# EAGLE design final_stm_shield (EAGLE 9.5.2)
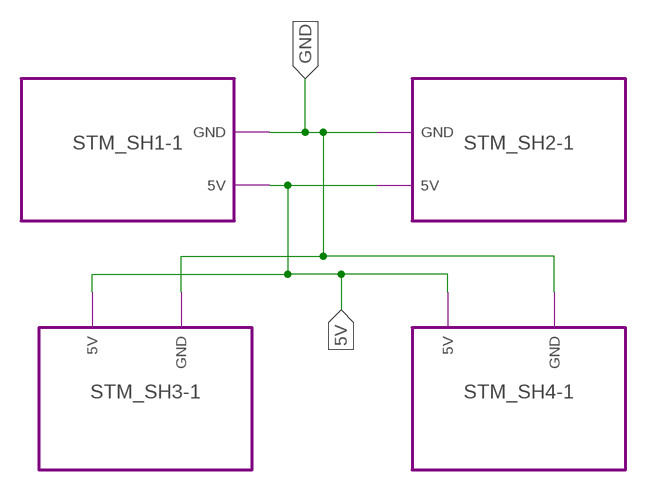
[diagram p0: schematic, sheet 1]

## Module instances
STM_SH1-1 = STM_SH1
STM_SH2-1 = STM_SH2
STM_SH3-1 = STM_SH3
STM_SH4-1 = STM_SH4

## Nets
5V: port STM_SH1-1.5V STM_SH2-1.5V STM_SH4-1.5V STM_SH3-1.5V
GND: port STM_SH1-1.GND STM_SH2-1.GND STM_SH4-1.GND STM_SH3-1.GND

## Library data of the parts

## Module STM_SH1
Ports: 5V(out) GND(out)
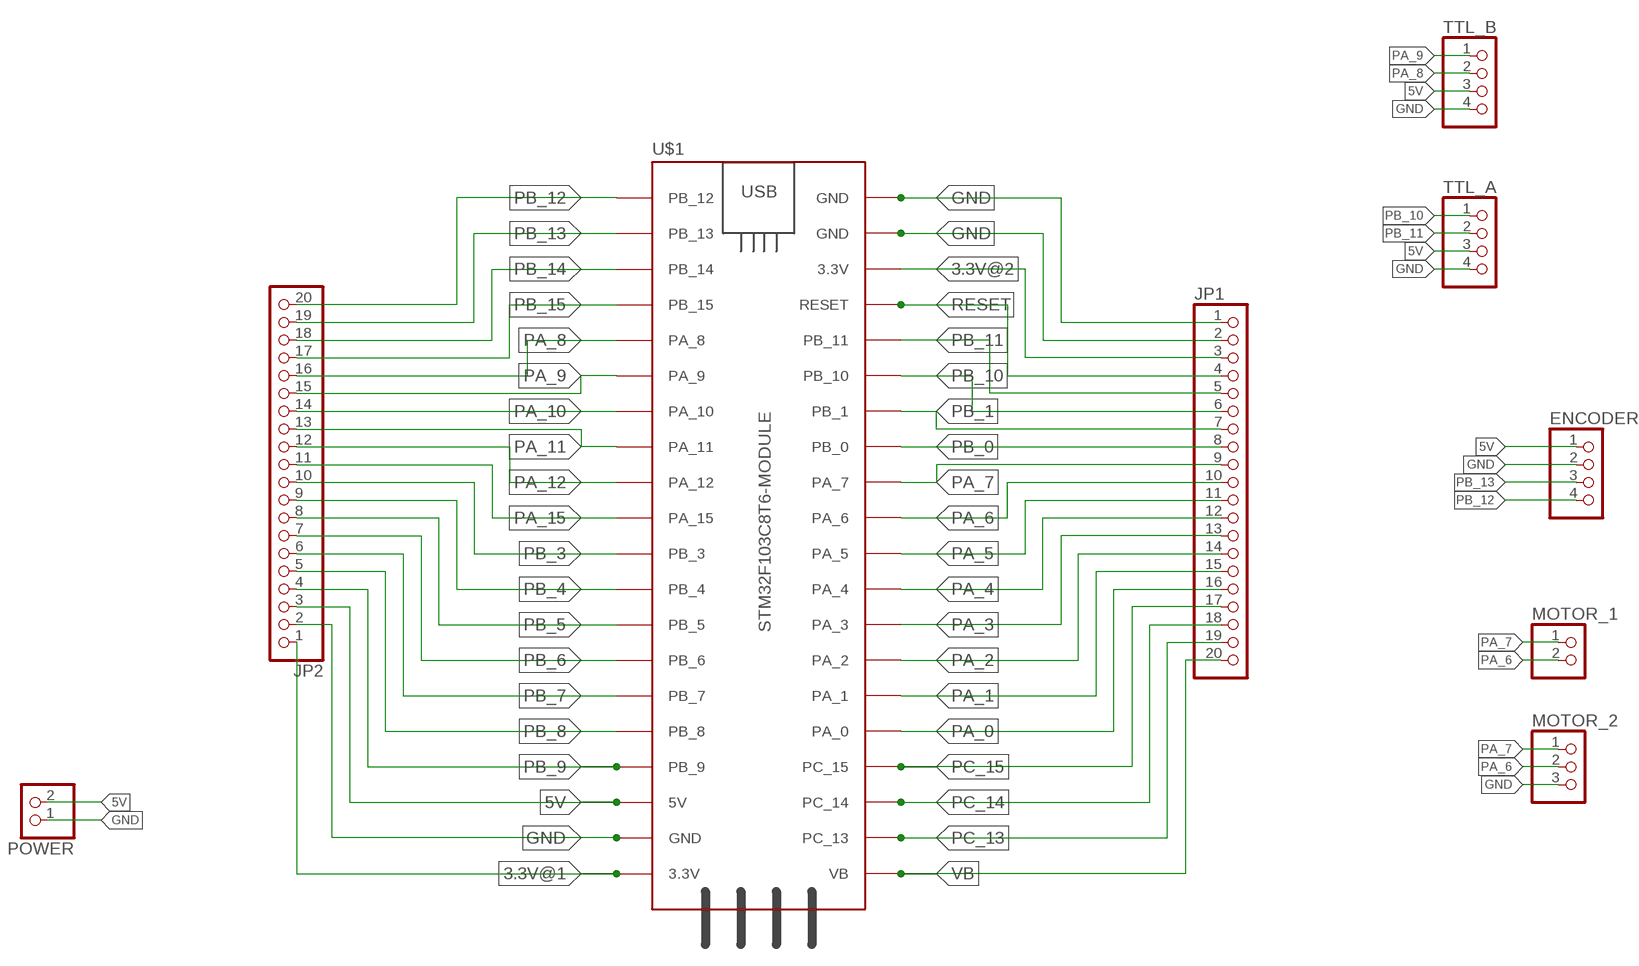
[diagram p1: schematic, module STM_SH1, sheet 1]

### Parts
ENCODER  PINHD-4_DATA  [1X04_DATA]
JP1  PINHD-1X20  [1X20]
JP2  PINHD-1X20  [1X20]
MOTOR_1  PINHD-2_DATA  [1X02_DATA]
MOTOR_2  PINHD-3_DATA  [1X03_DATA]
POWER  PINHD-2_DATA  [1X02_DATA]
TTL_A  PINHD-4_DATA  [1X04_DATA]
TTL_B  PINHD-4_DATA  [1X04_DATA]
U$1  STM32F103C8T6-MODULE  [STM32F103C8T6-MODULE]

### Nets
3.3V@1: JP2.1 U$1.3.3V_1(3.3V)
3.3V@2: JP1.3 U$1.3.3V_2(3.3V)
5V: ENCODER.1 JP2.3 POWER.2 TTL_A.3 TTL_B.3 U$1.5V
GND: ENCODER.2 JP1.1 JP1.2 JP2.2 MOTOR_2.3 POWER.1 TTL_A.4 TTL_B.4 U$1.GND_1(GND) U$1.GND_2(GND) U$1.GND_3(GND)
PA_0: JP1.16 U$1.PA_0
PA_1: JP1.15 U$1.PA_1
PA_2: JP1.14 U$1.PA_2
PA_3: JP1.13 U$1.PA_3
PA_4: JP1.12 U$1.PA_4
PA_5: JP1.11 U$1.PA_5
PA_6: JP1.10 MOTOR_1.2 MOTOR_2.2 U$1.PA_6
PA_7: JP1.9 MOTOR_1.1 MOTOR_2.1 U$1.PA_7
PA_8: JP2.16 TTL_B.2 U$1.PA_8
PA_9: JP2.15 TTL_B.1 U$1.PA_9
PA_10: JP2.14 U$1.PA_10
PA_11: JP2.13 U$1.PA_11
PA_12: JP2.12 U$1.PA_12
PA_15: JP2.11 U$1.PA_15
PB_0: JP1.8 U$1.PB_0
PB_1: JP1.7 U$1.PB_1
PB_3: JP2.10 U$1.PB_3
PB_4: JP2.9 U$1.PB_4
PB_5: JP2.8 U$1.PB_5
PB_6: JP2.7 U$1.PB_6
PB_7: JP2.6 U$1.PB_7
PB_8: JP2.5 U$1.PB_8
PB_9: JP2.4 U$1.PB_9
PB_10: JP1.6 TTL_A.1 U$1.PB_10
PB_11: JP1.5 TTL_A.2 U$1.PB_11
PB_12: ENCODER.4 JP2.20 U$1.PB_12
PB_13: ENCODER.3 JP2.19 U$1.PB_13
PB_14: JP2.18 U$1.PB_14
PB_15: JP2.17 U$1.PB_15
PC_13: JP1.19 U$1.PC_13
PC_14: JP1.18 U$1.PC_14
PC_15: JP1.17 U$1.PC_15
RESET: JP1.4 U$1.RESET
VB: JP1.20 U$1.VB

### Library data of the parts
ENCODER TTL_A TTL_B = MIA_LIBRARY-2-2-2:PINHD-4_DATA: PIN HEADER
JP1 JP2 = MIA_LIBRARY-2-2-2:PINHD-1X20: PIN HEADER
MOTOR_1 POWER = MIA_LIBRARY-2-2-2:PINHD-2_DATA: PIN HEADER
MOTOR_2 = MIA_LIBRARY-2-2-2:PINHD-3_DATA: PIN HEADER
U$1 = MIA_LIBRARY-2-2-2:STM32F103C8T6-MODULE: STM32F103C8T6 module with ARM Cortex-3, 20kB SRAM, 64kB Flash, 72MHz

## Module STM_SH2
Ports: 5V(in) GND(in)
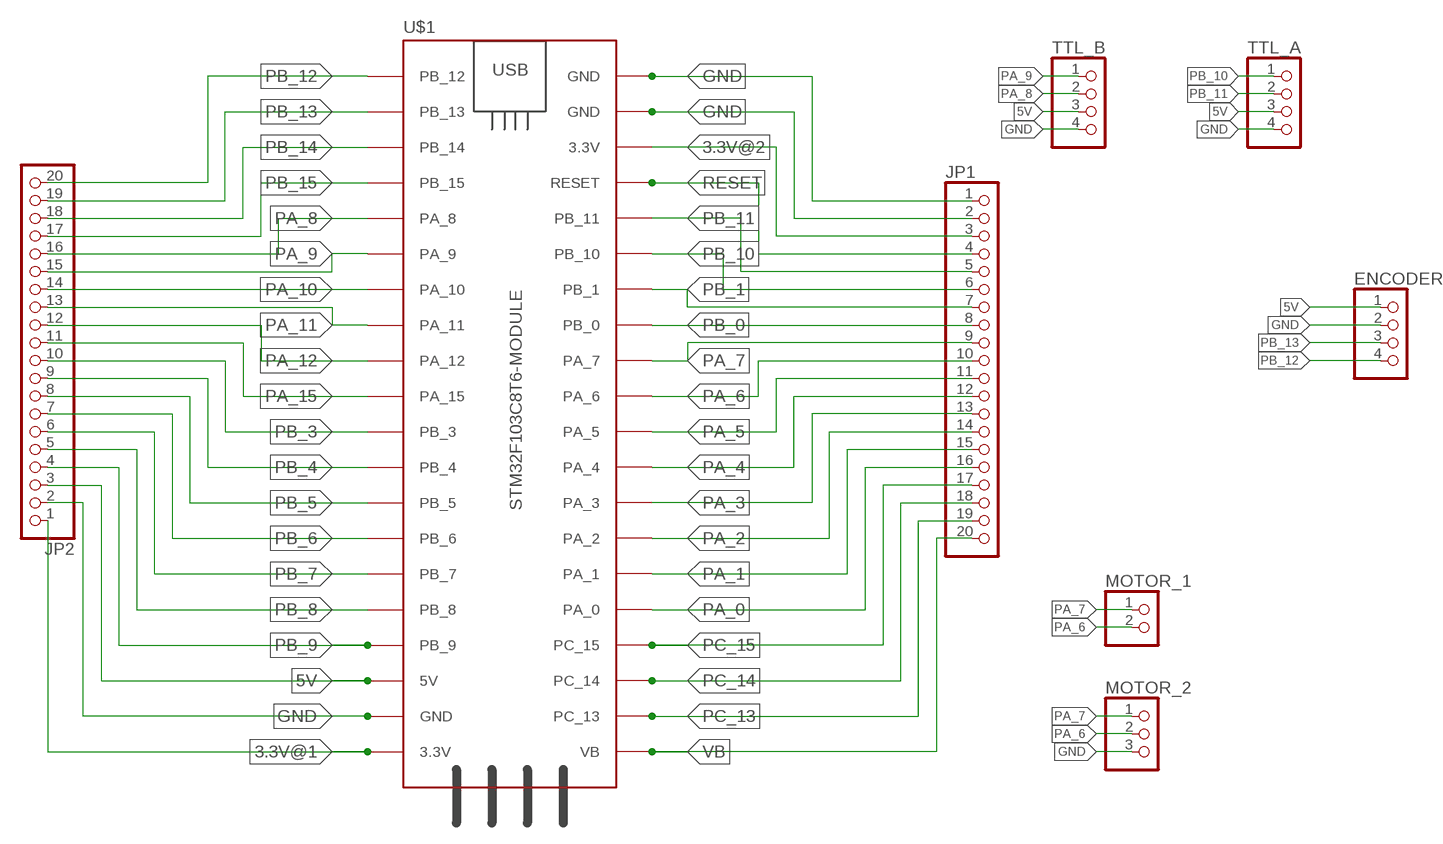
[diagram p2: schematic, module STM_SH2, sheet 1]

### Parts
ENCODER  PINHD-4_DATA  [1X04_DATA]
JP1  PINHD-1X20  [1X20]
JP2  PINHD-1X20  [1X20]
MOTOR_1  PINHD-2_DATA  [1X02_DATA]
MOTOR_2  PINHD-3_DATA  [1X03_DATA]
TTL_A  PINHD-4_DATA  [1X04_DATA]
TTL_B  PINHD-4_DATA  [1X04_DATA]
U$1  STM32F103C8T6-MODULE  [STM32F103C8T6-MODULE]

### Nets
3.3V@1: JP2.1 U$1.3.3V_1(3.3V)
3.3V@2: JP1.3 U$1.3.3V_2(3.3V)
5V: ENCODER.1 JP2.3 TTL_A.3 TTL_B.3 U$1.5V
GND: ENCODER.2 JP1.1 JP1.2 JP2.2 MOTOR_2.3 TTL_A.4 TTL_B.4 U$1.GND_1(GND) U$1.GND_2(GND) U$1.GND_3(GND)
PA_0: JP1.16 U$1.PA_0
PA_1: JP1.15 U$1.PA_1
PA_2: JP1.14 U$1.PA_2
PA_3: JP1.13 U$1.PA_3
PA_4: JP1.12 U$1.PA_4
PA_5: JP1.11 U$1.PA_5
PA_6: JP1.10 MOTOR_1.2 MOTOR_2.2 U$1.PA_6
PA_7: JP1.9 MOTOR_1.1 MOTOR_2.1 U$1.PA_7
PA_8: JP2.16 TTL_B.2 U$1.PA_8
PA_9: JP2.15 TTL_B.1 U$1.PA_9
PA_10: JP2.14 U$1.PA_10
PA_11: JP2.13 U$1.PA_11
PA_12: JP2.12 U$1.PA_12
PA_15: JP2.11 U$1.PA_15
PB_0: JP1.8 U$1.PB_0
PB_1: JP1.7 U$1.PB_1
PB_3: JP2.10 U$1.PB_3
PB_4: JP2.9 U$1.PB_4
PB_5: JP2.8 U$1.PB_5
PB_6: JP2.7 U$1.PB_6
PB_7: JP2.6 U$1.PB_7
PB_8: JP2.5 U$1.PB_8
PB_9: JP2.4 U$1.PB_9
PB_10: JP1.6 TTL_A.1 U$1.PB_10
PB_11: JP1.5 TTL_A.2 U$1.PB_11
PB_12: ENCODER.4 JP2.20 U$1.PB_12
PB_13: ENCODER.3 JP2.19 U$1.PB_13
PB_14: JP2.18 U$1.PB_14
PB_15: JP2.17 U$1.PB_15
PC_13: JP1.19 U$1.PC_13
PC_14: JP1.18 U$1.PC_14
PC_15: JP1.17 U$1.PC_15
RESET: JP1.4 U$1.RESET
VB: JP1.20 U$1.VB

### Library data of the parts
ENCODER TTL_A TTL_B = MIA_LIBRARY-2-2-2:PINHD-4_DATA: PIN HEADER
JP1 JP2 = MIA_LIBRARY-2-2-2:PINHD-1X20: PIN HEADER
MOTOR_1 = MIA_LIBRARY-2-2-2:PINHD-2_DATA: PIN HEADER
MOTOR_2 = MIA_LIBRARY-2-2-2:PINHD-3_DATA: PIN HEADER
U$1 = MIA_LIBRARY-2-2-2:STM32F103C8T6-MODULE: STM32F103C8T6 module with ARM Cortex-3, 20kB SRAM, 64kB Flash, 72MHz

## Module STM_SH3
Ports: 5V(in) GND(in)
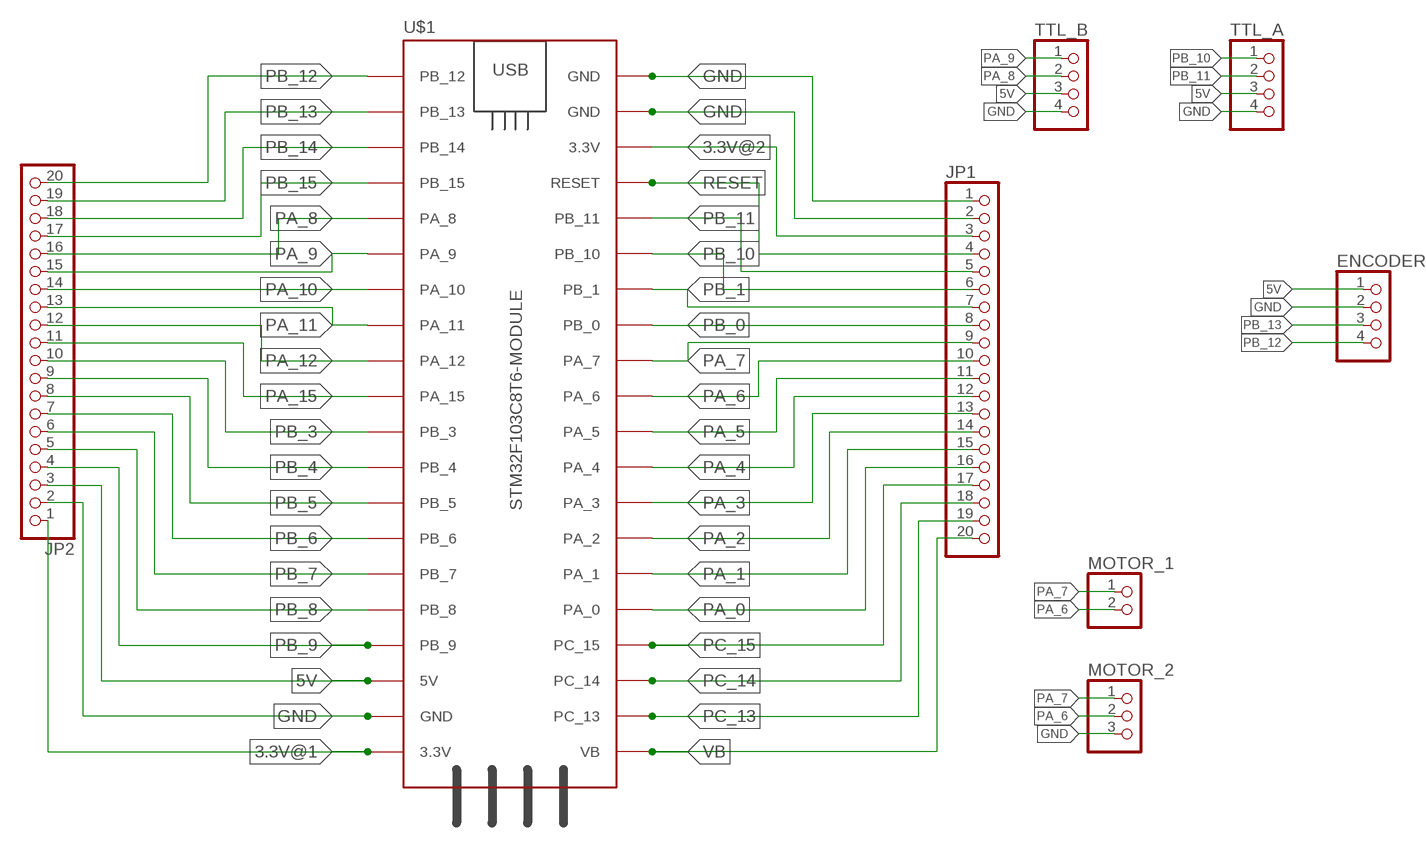
[diagram p3: schematic, module STM_SH3, sheet 1]

### Parts
ENCODER  PINHD-4_DATA  [1X04_DATA]
JP1  PINHD-1X20  [1X20]
JP2  PINHD-1X20  [1X20]
MOTOR_1  PINHD-2_DATA  [1X02_DATA]
MOTOR_2  PINHD-3_DATA  [1X03_DATA]
TTL_A  PINHD-4_DATA  [1X04_DATA]
TTL_B  PINHD-4_DATA  [1X04_DATA]
U$1  STM32F103C8T6-MODULE  [STM32F103C8T6-MODULE]

### Nets
3.3V@1: JP2.1 U$1.3.3V_1(3.3V)
3.3V@2: JP1.3 U$1.3.3V_2(3.3V)
5V: ENCODER.1 JP2.3 TTL_A.3 TTL_B.3 U$1.5V
GND: ENCODER.2 JP1.1 JP1.2 JP2.2 MOTOR_2.3 TTL_A.4 TTL_B.4 U$1.GND_1(GND) U$1.GND_2(GND) U$1.GND_3(GND)
PA_0: JP1.16 U$1.PA_0
PA_1: JP1.15 U$1.PA_1
PA_2: JP1.14 U$1.PA_2
PA_3: JP1.13 U$1.PA_3
PA_4: JP1.12 U$1.PA_4
PA_5: JP1.11 U$1.PA_5
PA_6: JP1.10 MOTOR_1.2 MOTOR_2.2 U$1.PA_6
PA_7: JP1.9 MOTOR_1.1 MOTOR_2.1 U$1.PA_7
PA_8: JP2.16 TTL_B.2 U$1.PA_8
PA_9: JP2.15 TTL_B.1 U$1.PA_9
PA_10: JP2.14 U$1.PA_10
PA_11: JP2.13 U$1.PA_11
PA_12: JP2.12 U$1.PA_12
PA_15: JP2.11 U$1.PA_15
PB_0: JP1.8 U$1.PB_0
PB_1: JP1.7 U$1.PB_1
PB_3: JP2.10 U$1.PB_3
PB_4: JP2.9 U$1.PB_4
PB_5: JP2.8 U$1.PB_5
PB_6: JP2.7 U$1.PB_6
PB_7: JP2.6 U$1.PB_7
PB_8: JP2.5 U$1.PB_8
PB_9: JP2.4 U$1.PB_9
PB_10: JP1.6 TTL_A.1 U$1.PB_10
PB_11: JP1.5 TTL_A.2 U$1.PB_11
PB_12: ENCODER.4 JP2.20 U$1.PB_12
PB_13: ENCODER.3 JP2.19 U$1.PB_13
PB_14: JP2.18 U$1.PB_14
PB_15: JP2.17 U$1.PB_15
PC_13: JP1.19 U$1.PC_13
PC_14: JP1.18 U$1.PC_14
PC_15: JP1.17 U$1.PC_15
RESET: JP1.4 U$1.RESET
VB: JP1.20 U$1.VB

### Library data of the parts
ENCODER TTL_A TTL_B = MIA_LIBRARY-2-2-2:PINHD-4_DATA: PIN HEADER
JP1 JP2 = MIA_LIBRARY-2-2-2:PINHD-1X20: PIN HEADER
MOTOR_1 = MIA_LIBRARY-2-2-2:PINHD-2_DATA: PIN HEADER
MOTOR_2 = MIA_LIBRARY-2-2-2:PINHD-3_DATA: PIN HEADER
U$1 = MIA_LIBRARY-2-2-2:STM32F103C8T6-MODULE: STM32F103C8T6 module with ARM Cortex-3, 20kB SRAM, 64kB Flash, 72MHz

## Module STM_SH4
Ports: 5V(in) GND(in)
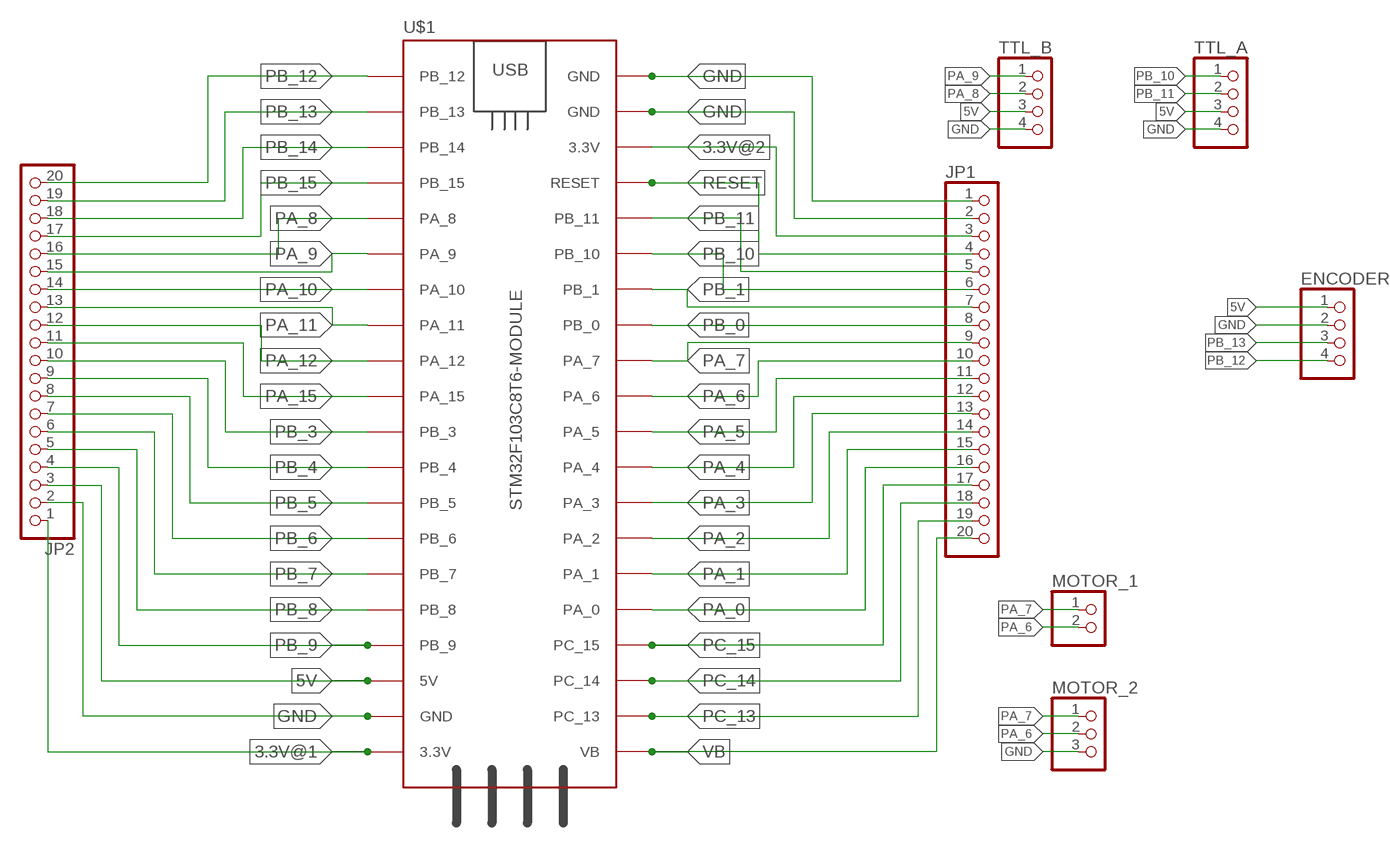
[diagram p4: schematic, module STM_SH4, sheet 1]

### Parts
ENCODER  PINHD-4_DATA  [1X04_DATA]
JP1  PINHD-1X20  [1X20]
JP2  PINHD-1X20  [1X20]
MOTOR_1  PINHD-2_DATA  [1X02_DATA]
MOTOR_2  PINHD-3_DATA  [1X03_DATA]
TTL_A  PINHD-4_DATA  [1X04_DATA]
TTL_B  PINHD-4_DATA  [1X04_DATA]
U$1  STM32F103C8T6-MODULE  [STM32F103C8T6-MODULE]

### Nets
3.3V@1: JP2.1 U$1.3.3V_1(3.3V)
3.3V@2: JP1.3 U$1.3.3V_2(3.3V)
5V: ENCODER.1 JP2.3 TTL_A.3 TTL_B.3 U$1.5V
GND: ENCODER.2 JP1.1 JP1.2 JP2.2 MOTOR_2.3 TTL_A.4 TTL_B.4 U$1.GND_1(GND) U$1.GND_2(GND) U$1.GND_3(GND)
PA_0: JP1.16 U$1.PA_0
PA_1: JP1.15 U$1.PA_1
PA_2: JP1.14 U$1.PA_2
PA_3: JP1.13 U$1.PA_3
PA_4: JP1.12 U$1.PA_4
PA_5: JP1.11 U$1.PA_5
PA_6: JP1.10 MOTOR_1.2 MOTOR_2.2 U$1.PA_6
PA_7: JP1.9 MOTOR_1.1 MOTOR_2.1 U$1.PA_7
PA_8: JP2.16 TTL_B.2 U$1.PA_8
PA_9: JP2.15 TTL_B.1 U$1.PA_9
PA_10: JP2.14 U$1.PA_10
PA_11: JP2.13 U$1.PA_11
PA_12: JP2.12 U$1.PA_12
PA_15: JP2.11 U$1.PA_15
PB_0: JP1.8 U$1.PB_0
PB_1: JP1.7 U$1.PB_1
PB_3: JP2.10 U$1.PB_3
PB_4: JP2.9 U$1.PB_4
PB_5: JP2.8 U$1.PB_5
PB_6: JP2.7 U$1.PB_6
PB_7: JP2.6 U$1.PB_7
PB_8: JP2.5 U$1.PB_8
PB_9: JP2.4 U$1.PB_9
PB_10: JP1.6 TTL_A.1 U$1.PB_10
PB_11: JP1.5 TTL_A.2 U$1.PB_11
PB_12: ENCODER.4 JP2.20 U$1.PB_12
PB_13: ENCODER.3 JP2.19 U$1.PB_13
PB_14: JP2.18 U$1.PB_14
PB_15: JP2.17 U$1.PB_15
PC_13: JP1.19 U$1.PC_13
PC_14: JP1.18 U$1.PC_14
PC_15: JP1.17 U$1.PC_15
RESET: JP1.4 U$1.RESET
VB: JP1.20 U$1.VB

### Library data of the parts
ENCODER TTL_A TTL_B = MIA_LIBRARY-2-2-2:PINHD-4_DATA: PIN HEADER
JP1 JP2 = MIA_LIBRARY-2-2-2:PINHD-1X20: PIN HEADER
MOTOR_1 = MIA_LIBRARY-2-2-2:PINHD-2_DATA: PIN HEADER
MOTOR_2 = MIA_LIBRARY-2-2-2:PINHD-3_DATA: PIN HEADER
U$1 = MIA_LIBRARY-2-2-2:STM32F103C8T6-MODULE: STM32F103C8T6 module with ARM Cortex-3, 20kB SRAM, 64kB Flash, 72MHz

## Board
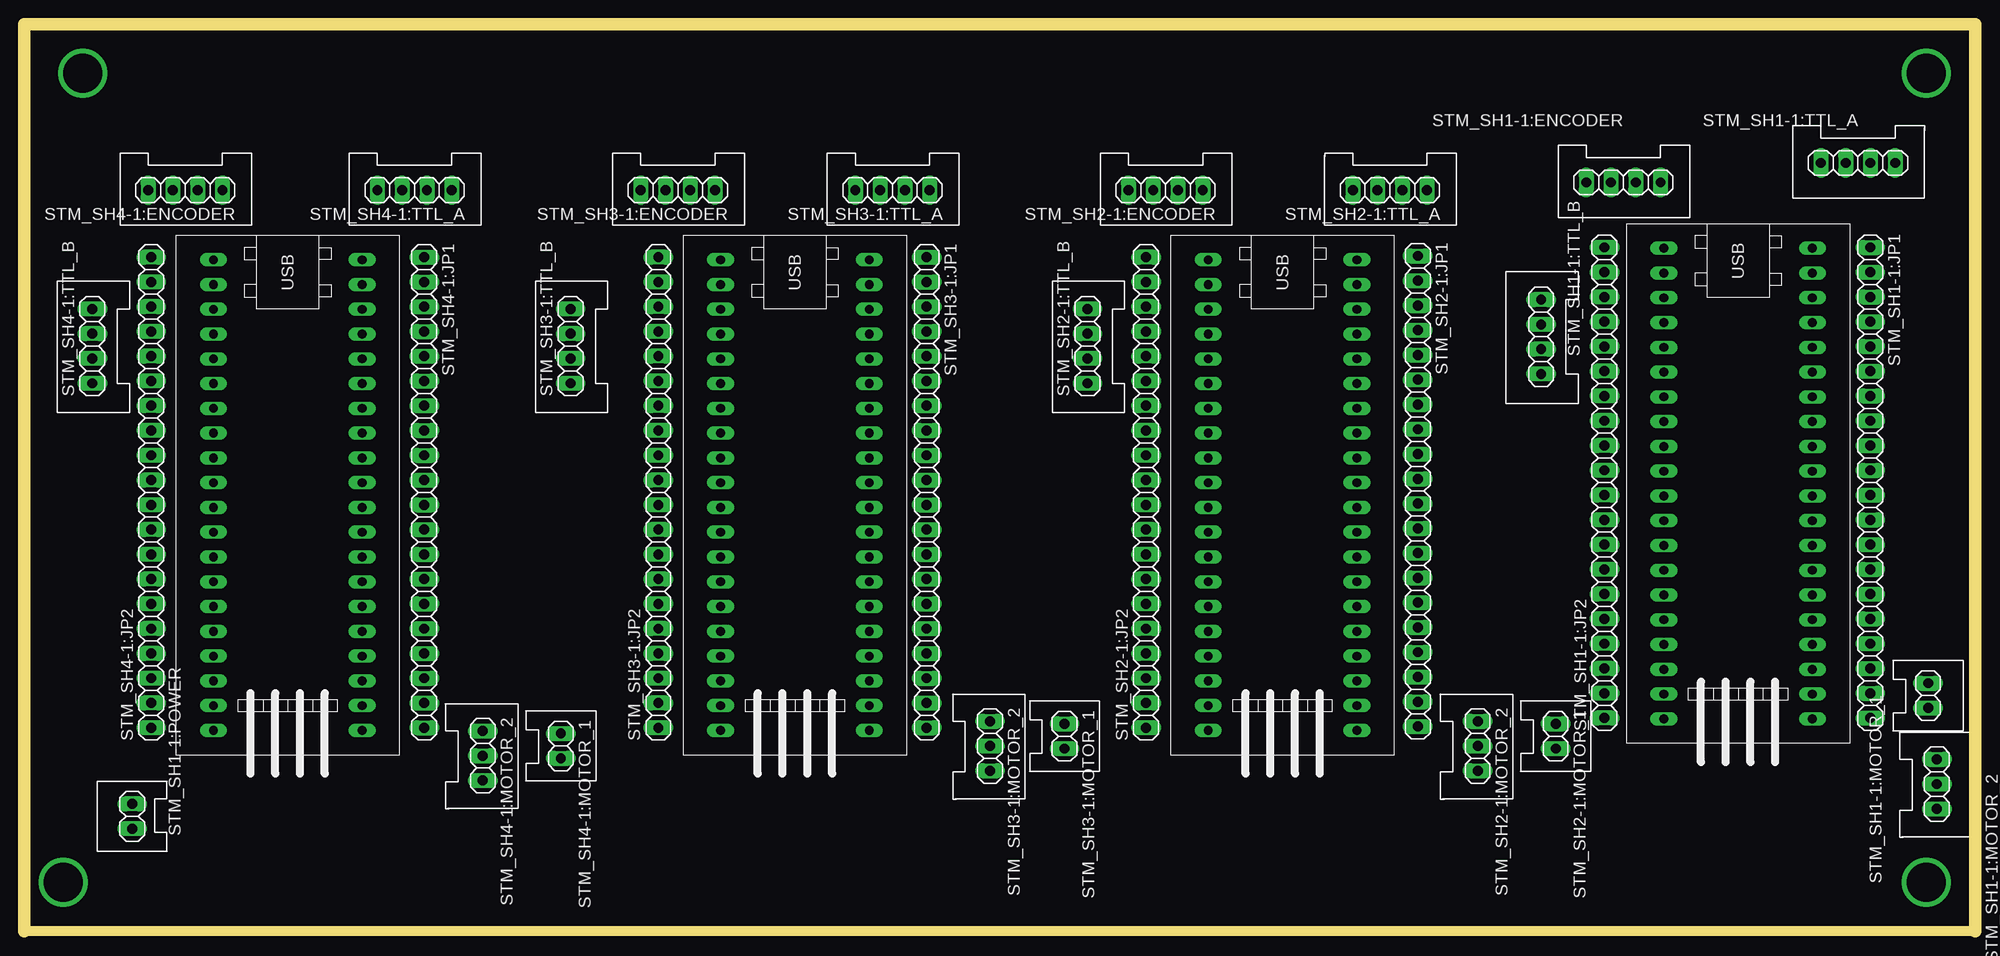
[diagram p5: board, top side]
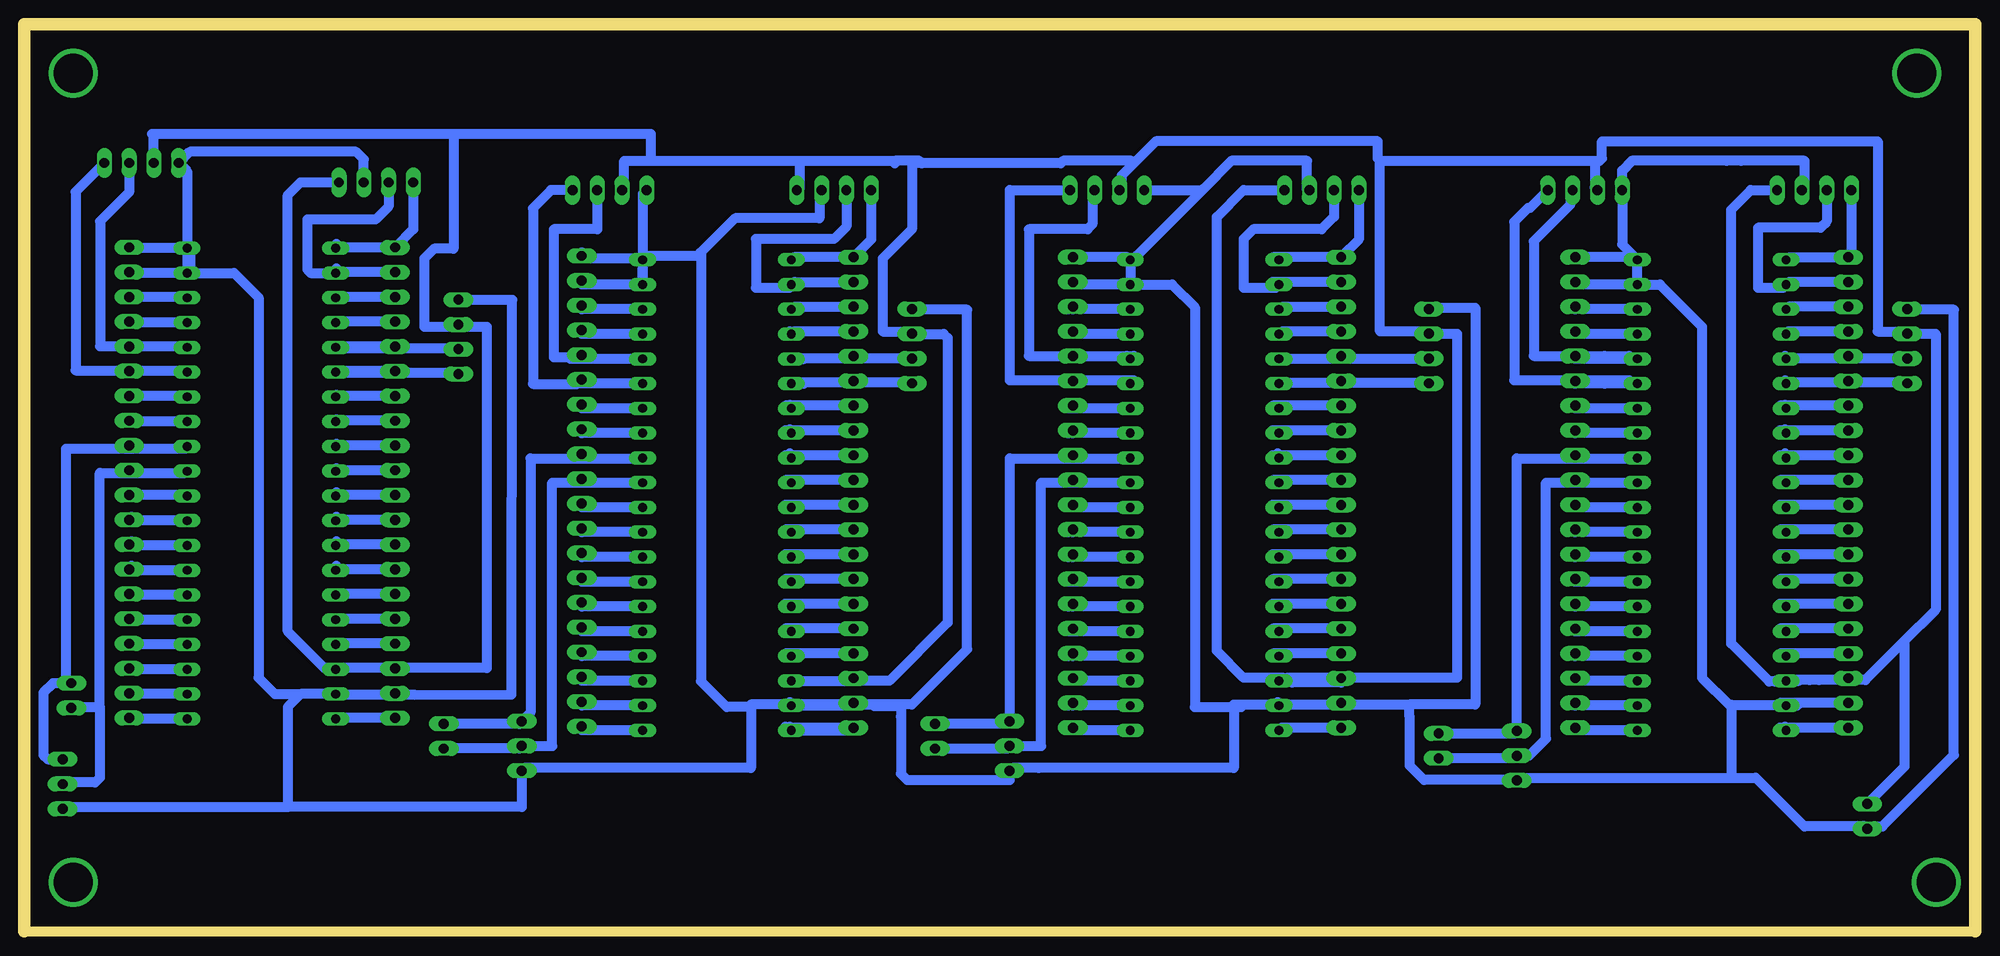
[diagram p6: board, bottom side, seen from below]

Size 200 x 93 mm. Coordinates in mm from the lower left corner, seen from the top.
Outline: 200,0 0,0 0,93 200,93 200,0
Copper layers (1*16): Top 0.035mm / dielectric 1.5mm / Bottom 0.035mm
Design rules "default *": minimum track width 1mm, minimum drill 0.35mm, track to track 0.8mm, track to pad 0.8mm, pad to pad 6mil, via to via 6mil, smd to smd 6mil, copper to edge 0.8mm, drill to drill 6mil, minimum pad ring 10mil, minimum via ring 8mil, stop-mask expansion 4mil, vias tented up to drill 0mil, thermal gap 10mil

### Footprints (pad centres in the part's own frame; a part is rotated, then mirrored left to right if it is on the bottom)
1X04_DATA = drill 1.016 long: 1 -3.81,0; 2 -1.27,0; 3 1.27,0; 4 3.81,0
1X20 = drill 1.016 long: 1 -24.13,0; 2 -21.59,0; 3 -19.05,0; 4 -16.51,0; 5 -13.97,0; 6 -11.43,0; 7 -8.89,0; 8 -6.35,0; 9 -3.81,0; 10 -1.27,0; 11 1.27,0; 12 3.81,0; 13 6.35,0; 14 8.89,0; 15 11.43,0; 16 13.97,0; 17 16.51,0; 18 19.05,0; 19 21.59,0; 20 24.13,0
1X02_DATA = drill 1.016 long: 1 -1.27,0; 2 1.27,0
1X03_DATA = drill 1.016 long: 1 -2.54,0; 2 0,0; 3 2.54,0
STM32F103C8T6-MODULE = drill 0.9 long: 3.3V_1 25.4,-7.62; 3.3V_2 -17.78,7.62; 5V 20.32,-7.62; GND_1 22.86,-7.62; GND_2 -20.32,7.62; GND_3 -22.86,7.62; PA_0 15.24,7.62; PA_1 12.7,7.62; PA_2 10.16,7.62; PA_3 7.62,7.62; PA_4 5.08,7.62; PA_5 2.54,7.62; PA_6 0,7.62; PA_7 -2.54,7.62; PA_8 -12.7,-7.62; PA_9 -10.16,-7.62; PA_10 -7.62,-7.62; PA_11 -5.08,-7.62; PA_12 -2.54,-7.62; PA_15 0,-7.62; PB_0 -5.08,7.62; PB_1 -7.62,7.62; PB_3 2.54,-7.62; PB_4 5.08,-7.62; PB_5 7.62,-7.62; PB_6 10.16,-7.62; PB_7 12.7,-7.62; PB_8 15.24,-7.62; PB_9 17.78,-7.62; PB_10 -10.16,7.62; PB_11 -12.7,7.62; PB_12 -22.86,-7.62; PB_13 -20.32,-7.62; PB_14 -17.78,-7.62; PB_15 -15.24,-7.62; PC_13 22.86,7.62; PC_14 20.32,7.62; PC_15 17.78,7.62; RESET -15.24,7.62; VB 25.4,7.62

### Placement (x,y rotation side)
STM_SH1-1:ENCODER  [1X04_DATA]  163.94,76.79 180 top
STM_SH1-1:JP1  [1X20]  189.25,46 270 top
STM_SH1-1:JP2  [1X20]  162,46 90 top
STM_SH1-1:MOTOR_1  [1X02_DATA]  195.18,24.17 270 top
STM_SH1-1:MOTOR_2  [1X03_DATA]  196.08,15.09 270 top
STM_SH1-1:POWER  [1X02_DATA]  11.06,11.78 90 top
STM_SH1-1:TTL_A  [1X04_DATA]  187.99,78.79 180 top
STM_SH1-1:TTL_B  [1X04_DATA]  155.5,60.96 90 top
STM_SH1-1:U$1  STM32F103C8T6-MODULE  [STM32F103C8T6-MODULE]  175.7,47.18 270 top
STM_SH2-1:ENCODER  [1X04_DATA]  117,76 180 top
STM_SH2-1:JP1  [1X20]  142.86,45.13 270 top
STM_SH2-1:JP2  [1X20]  115,45 90 top
STM_SH2-1:MOTOR_1  [1X02_DATA]  157,20 270 top
STM_SH2-1:MOTOR_2  [1X03_DATA]  149,19 270 top
STM_SH2-1:TTL_A  [1X04_DATA]  140,76 180 top
STM_SH2-1:TTL_B  [1X04_DATA]  109,60 90 top
STM_SH2-1:U$1  STM32F103C8T6-MODULE  [STM32F103C8T6-MODULE]  129,46 270 top
STM_SH3-1:ENCODER  [1X04_DATA]  67,76 180 top
STM_SH3-1:JP1  [1X20]  92.51,45 270 top
STM_SH3-1:JP2  [1X20]  65,45 90 top
STM_SH3-1:MOTOR_1  [1X02_DATA]  106.64,20 270 top
STM_SH3-1:MOTOR_2  [1X03_DATA]  99,19 270 top
STM_SH3-1:TTL_A  [1X04_DATA]  89,76 180 top
STM_SH3-1:TTL_B  [1X04_DATA]  56,60 90 top
STM_SH3-1:U$1  STM32F103C8T6-MODULE  [STM32F103C8T6-MODULE]  79,46 270 top
STM_SH4-1:ENCODER  [1X04_DATA]  16.49,76 180 top
STM_SH4-1:JP1  [1X20]  41,45 270 top
STM_SH4-1:JP2  [1X20]  13,45 90 top
STM_SH4-1:MOTOR_1  [1X02_DATA]  55,19 270 top
STM_SH4-1:MOTOR_2  [1X03_DATA]  47,18 270 top
STM_SH4-1:TTL_A  [1X04_DATA]  40,76 180 top
STM_SH4-1:TTL_B  [1X04_DATA]  6.97,60 90 top
STM_SH4-1:U$1  STM32F103C8T6-MODULE  [STM32F103C8T6-MODULE]  27,46 270 top

### Tracks (layer width: path | path; a pad name or v marks a point on that pad's centre or on a via)
5V
  Bottom 1: 162,27 152.59,27 152.59,62 155.46,62 STM_SH1-1:TTL_B.3 155.96,62.25 156,62.25 155,62 159,62 159,69 158,70 156,70 156,81.75 | 162,27 168,27 STM_SH1-1:U$1.5V 168.5,27 169.25,27 173,30.75 173,75.5 171.71,76.79 STM_SH1-1:ENCODER.1 | 105.33,31.67 105.33,60.83 105.75,61.25 109,61.25 STM_SH2-1:TTL_B.3 109.25,61.5 112,61.5 112,69 109,72 109,78.75 108,78.75 93.75,78.75 93.5,79 86.5,79 86.25,78.75 | 121,76 STM_SH2-1:ENCODER.1 120.5,76.25 120.5,79 | 135.5,79 138.5,79 138.5,76 STM_SH2-1:TTL_A.3 | 135.5,79 120.5,79 | 156,81.75 135.75,81.75 135.75,79.25 135.5,79 | 156,81.75 186.91,81.75 186.72,81.55 STM_SH1-1:TTL_A.3 | 110.75,78.75 110.75,79 120.5,79 | 17,25.75 16,25.75 11.25,25.75 7.25,29.75 | 19,25.75 20,25.75 | STM_SH1-1:POWER.2 7.25,16.86 7.25,29.75 | 7.25,29.75 4.05,32.95 4.05,61.27 STM_SH4-1:TTL_B.3 7.22,61.5 10,61.5 10,81 38.25,81 38.25,79.25 38.5,79 39,79 | 20.5,25.62 21.11,25.62 25,29.5 25,74 23,76 STM_SH4-1:ENCODER.1 | 70.5,26 53.11,26 53.11,61.27 STM_SH3-1:TTL_B.3 56.25,61.5 61,61.5 61,79 | 61,79 39,79 | 39,79 39,76.27 STM_SH4-1:TTL_A.3 | 71.25,26 71.5,26 | 71.5,26 75,26 77.75,28.75 77.75,73.25 75,76 STM_SH3-1:ENCODER.1 | 86.25,78.75 84,81 61.25,81 61.25,79.25 61,79 | 86.25,78.75 87.5,77.5 87.5,76 STM_SH3-1:TTL_A.3 | 71.5,26 STM_SH3-1:U$1.5V | STM_SH3-1:U$1.5V 71,26 70.5,26 | 70.5,26 70,25.5 65,25.5 STM_SH3-1:JP2.3 | 70.5,26 STM_SH3-1:U$1.5V | 162,27 STM_SH1-1:JP2.3
  Bottom 1.016: STM_SH2-1:U$1.5V 115.27,25.68 | 115.27,25.68 STM_SH2-1:JP2.3 | 17,25.75 18,25.75 | 18,25.75 19,25.75 | 20.5,25.62 20.44,25.68 STM_SH4-1:U$1.5V 18.07,25.68 18,25.75 | STM_SH4-1:JP2.3 13.2,25.75 16,25.75 | 108,78.75 108.25,79 110.75,79 | 115.27,25.68 111.32,25.68 105.33,31.67
GND
  Bottom 1: STM_SH1-1:U$1.GND_1 168,24.25 164,24.25 160,24.25 150.06,24.28 149.97,64.75 155.46,64.75 STM_SH1-1:TTL_B.4 | STM_SH1-1:MOTOR_2.3 196,12.75 173,12.75 149,12.75 STM_SH2-1:MOTOR_2.3 148.75,16.75 125.5,16.75 125.5,23 125.5,23.25 113,23.25 110,23.25 | 110,23.25 109,23.25 103.35,28.9 103.35,63.75 109,63.75 STM_SH2-1:TTL_B.4 | 110.14,22 110.14,23.11 110,23.25 | 109.5,15.5 99,15.5 STM_SH3-1:MOTOR_2.3 | 25,23.25 25,15.75 | STM_SH4-1:TTL_B.4 6.97,63.75 2.17,63.75 2.17,18.08 9.5,10.75 10.75,10.75 STM_SH1-1:POWER.1 11.25,10.75 17.5,10.75 22.5,15.75 25,15.75 | 71.5,23.25 75,23.25 76,23.25 76,16.75 96,16.75 | 71.5,23.25 63,23.25 58,23.25 51.24,23.25 51.24,63.94 55.87,63.94 STM_SH3-1:TTL_B.4 | 58,22 58,17 56.5,15.5 47,15.5 STM_SH4-1:MOTOR_2.3 46.75,15.75 25,15.75 | 184.25,78.75 STM_SH1-1:TTL_A.4 | 165.25,77 STM_SH1-1:ENCODER.2 | STM_SH2-1:TTL_A.4 136.59,75.59 136.59,69 | 136.59,69 136.59,68 136.59,66.5 | 136.5,69.25 136,69.25 131,69.25 130.62,69.62 127.13,73.12 118.5,73.12 118.5,76 STM_SH2-1:ENCODER.2 | 85.25,76 STM_SH3-1:TTL_A.4 | 86,69.25 79.12,76.12 76.25,79 68.5,79 68.5,76 STM_SH3-1:ENCODER.2 | STM_SH4-1:TTL_A.4 36.25,75.94 36.25,75.75 | 25.5,79 24,79 17.5,79 17.5,76.26 STM_SH4-1:ENCODER.2 | STM_SH2-1:U$1.GND_1 121.5,23.5 121.5,23 | STM_SH2-1:U$1.GND_3 137,69 136.59,69 | STM_SH2-1:JP1.2 142.86,66.32 | 142.86,69.63 STM_SH2-1:JP1.1 142.86,69 | STM_SH3-1:U$1.GND_1 71.5,23.5 71.5,23.25
  Bottom 1.016: STM_SH1-1:U$1.GND_3 183.32,77.93 STM_SH1-1:TTL_A.4 183.03,79.94 166,79.94 165.21,79.15 STM_SH1-1:ENCODER.2 | STM_SH1-1:U$1.GND_3 STM_SH1-1:U$1.GND_2 | STM_SH1-1:U$1.GND_3 189.16,70.04 STM_SH1-1:JP1.1 | STM_SH1-1:U$1.GND_3 183,69.72 183,67.5 | STM_SH1-1:U$1.GND_2 189.16,67.5 STM_SH1-1:JP1.2 | STM_SH1-1:U$1.GND_1 171.68,24.32 | 171.68,24.32 173,23 173,12.75 | STM_SH1-1:JP2.2 162.16,24.25 164,24.25 | 142.86,66.32 STM_SH2-1:U$1.GND_2 136.59,66.34 136.59,68 | 143,69 142.86,69 137,69 136.76,69 STM_SH2-1:U$1.GND_3 136.23,69.25 136,69.25 | STM_SH3-1:U$1.GND_3 86.39,68.86 86,69.25 | STM_SH3-1:U$1.GND_3 86.89,69.13 STM_SH3-1:JP1.1 | STM_SH3-1:U$1.GND_2 92.24,66.32 STM_SH3-1:JP1.2 | STM_SH3-1:TTL_A.4 79.25,76 79.12,76.12 | 24,79 35.21,79 36.19,78.02 STM_SH4-1:TTL_A.4 36.19,70.43 STM_SH4-1:U$1.GND_3 | STM_SH4-1:U$1.GND_2 STM_SH4-1:U$1.GND_3 | STM_SH4-1:U$1.GND_3 34.89,69.13 STM_SH4-1:JP1.1 | STM_SH4-1:U$1.GND_2 40.73,66.32 STM_SH4-1:JP1.2 | 58,22 58,23.25 | STM_SH3-1:JP2.2 64.84,23.25 63,23.25 | STM_SH4-1:JP2.2 18,23.41 | 18,23.41 20,23.41 | STM_SH4-1:U$1.GND_2 32.32,66.32 28,62 28,26 25.25,23.25 25,23.25 24.89,23.14 STM_SH4-1:U$1.GND_1 18.27,23.14 18,23.41 | STM_SH3-1:U$1.GND_3 STM_SH3-1:U$1.GND_2 | STM_SH3-1:U$1.GND_2 82.32,66.32 80,64 80,23 75.25,23 75,23.25 | 130.62,69.62 130.62,25.62 128,23 125.5,23 | 121.5,23 121,23 | STM_SH1-1:U$1.GND_2 178.5,67.5 176,65 176,26 174.32,24.32 171.68,24.32 | 110.14,23.11 112.86,23.11 113,23.25 114.84,23.25 STM_SH2-1:JP2.2 115.27,23.14 STM_SH2-1:U$1.GND_1 | 110.14,22 110.14,16.14 109.5,15.5 | 96,16.75 98.71,16.75 STM_SH3-1:MOTOR_2.3
N$1  (via drill 4)
  other vias: 6,88
N$2  (via drill 4)
  other vias: 195,88
N$3  (via drill 4)
  other vias: 4,5
N$4  (via drill 4)
  other vias: 195,5
STM_SH1-1:3.3V@1
  Bottom 1.016: STM_SH1-1:JP2.1 167.99,21.87 STM_SH1-1:U$1.3.3V_1
STM_SH1-1:3.3V@2
  Bottom 1.016: 183,64.96 STM_SH1-1:U$1.3.3V_2 183.41,65.05 STM_SH1-1:JP1.3
STM_SH1-1:PA_0
  Bottom 1: STM_SH1-1:JP1.16 189.5,32 189,31.94
  Bottom 1.016: 183,31.94 STM_SH1-1:U$1.PA_0 189,31.94
STM_SH1-1:PA_1
  Bottom 1: STM_SH1-1:JP1.15 189.5,34.5 189,34.48
  Bottom 1.016: 183,34.48 STM_SH1-1:U$1.PA_1 189,34.48
STM_SH1-1:PA_2
  Bottom 1: STM_SH1-1:JP1.14 189,37.5 189,37.02
  Bottom 1.016: 183,37.02 STM_SH1-1:U$1.PA_2 189,37.02
STM_SH1-1:PA_3
  Bottom 1: STM_SH1-1:JP1.13 189,40 189,39.56
  Bottom 1.016: 183,39.56 STM_SH1-1:U$1.PA_3 189,39.56
STM_SH1-1:PA_4
  Bottom 1: STM_SH1-1:JP1.12 189,42.5 189,42.1
  Bottom 1.016: 183,42.1 STM_SH1-1:U$1.PA_4 189,42.1
STM_SH1-1:PA_5
  Bottom 1.016: 183,44.64 STM_SH1-1:U$1.PA_5 183.41,44.73 STM_SH1-1:JP1.11
STM_SH1-1:PA_6
  Bottom 1: 189.5,47 192.25,47 192.25,23 194.99,23 STM_SH1-1:MOTOR_1.2 | 189.5,47 183.5,47 STM_SH1-1:U$1.PA_6 | 192.75,15.25 196,15.25 STM_SH1-1:MOTOR_2.2 | 189.5,47 STM_SH1-1:JP1.10
  Bottom 1.016: 183,47.18 STM_SH1-1:U$1.PA_6 | 192.25,23 192.25,15.75 192.75,15.25
STM_SH1-1:PA_7
  Bottom 1: 189.5,49.5 195.75,49.5 195.75,26.01 STM_SH1-1:MOTOR_1.1 | 189.5,49.5 183.5,49.5 STM_SH1-1:U$1.PA_7 | STM_SH1-1:MOTOR_2.1 197,17.63 197.5,17.63 | 189.5,49.5 STM_SH1-1:JP1.9
  Bottom 1.016: 183,49.72 STM_SH1-1:U$1.PA_7 | STM_SH1-1:MOTOR_1.1 197.09,25.44 198.06,24.47 198.06,18.06 197.63,17.63 197,17.63
STM_SH1-1:PA_8
  Bottom 1: 162,59.75 155.71,59.75 STM_SH1-1:TTL_B.2 | 162,59.75 168,59.75 STM_SH1-1:U$1.PA_8 | 162,60 STM_SH1-1:JP2.16 162,59.75
  Bottom 1.016: STM_SH1-1:JP2.16 168,59.97
STM_SH1-1:PA_9
  Bottom 1: 162,57.25 155.71,57.25 STM_SH1-1:TTL_B.1 | 162,57.25 168,57.25 STM_SH1-1:U$1.PA_9 | 162,57.5 STM_SH1-1:JP2.15 162,57.25
  Bottom 1.016: STM_SH1-1:JP2.15 168,57.43
STM_SH1-1:PA_10
  Bottom 1: STM_SH1-1:U$1.PA_10 168,55 168,54.89
  Bottom 1.016: STM_SH1-1:JP2.14 168,54.89
STM_SH1-1:PA_11
  Bottom 1: STM_SH1-1:U$1.PA_11 168,52.5 168,52.35
  Bottom 1.016: STM_SH1-1:JP2.13 168,52.35
STM_SH1-1:PA_12
  Bottom 1: STM_SH1-1:U$1.PA_12 168,50 168,49.81
  Bottom 1.016: STM_SH1-1:JP2.12 168,49.81
STM_SH1-1:PA_15
  Bottom 1: STM_SH1-1:U$1.PA_15 168,47.5 168,47.27
  Bottom 1.016: STM_SH1-1:JP2.11 168,47.27
STM_SH1-1:PB_0
  Bottom 1.016: 183,52.26 STM_SH1-1:U$1.PB_0 189.16,52.26 STM_SH1-1:JP1.8
STM_SH1-1:PB_1
  Bottom 1.016: 183,54.8 STM_SH1-1:U$1.PB_1 183.41,54.89 STM_SH1-1:JP1.7
STM_SH1-1:PB_3
  Bottom 1: STM_SH1-1:U$1.PB_3 168,45 168,44.73
  Bottom 1.016: STM_SH1-1:JP2.10 168,44.73
STM_SH1-1:PB_4
  Bottom 1: STM_SH1-1:U$1.PB_4 168,42.5 168,42.19
  Bottom 1.016: STM_SH1-1:JP2.9 168,42.19
STM_SH1-1:PB_5
  Bottom 1: STM_SH1-1:U$1.PB_5 168,40 168,39.65
  Bottom 1.016: STM_SH1-1:JP2.8 168,39.65
STM_SH1-1:PB_6
  Bottom 1: STM_SH1-1:U$1.PB_6 168,37.5 168,37.11
  Bottom 1.016: STM_SH1-1:JP2.7 168,37.11
STM_SH1-1:PB_7
  Bottom 1: STM_SH1-1:U$1.PB_7 168,34.5 168,34.57
  Bottom 1.016: STM_SH1-1:JP2.6 168,34.57
STM_SH1-1:PB_8
  Bottom 1: STM_SH1-1:U$1.PB_8 168,32 168,32.03
  Bottom 1.016: STM_SH1-1:JP2.5 168,32.03
STM_SH1-1:PB_9
  Bottom 1: STM_SH1-1:U$1.PB_9 168,29.5 168,29.49
  Bottom 1.016: STM_SH1-1:JP2.4 168,29.49
STM_SH1-1:PB_10
  Bottom 1: 189.5,57.5 194.75,57.5 194.75,75.84 STM_SH1-1:TTL_A.1 | 189.5,57.5 183.5,57.5 STM_SH1-1:U$1.PB_10 | 189.5,57.5 STM_SH1-1:JP1.6
  Bottom 1.016: 183,57.34 STM_SH1-1:U$1.PB_10
STM_SH1-1:PB_11
  Bottom 1: 189.5,60 192.25,60 192.25,72.8 189.26,75.79 STM_SH1-1:TTL_A.2 | 189.5,60 183.5,60 STM_SH1-1:U$1.PB_11 | 189.5,60 STM_SH1-1:JP1.5
  Bottom 1.016: 183,59.88 STM_SH1-1:U$1.PB_11
STM_SH1-1:PB_12
  Bottom 1: 168,70.25 STM_SH1-1:U$1.PB_12 168,70.5 168,70.13
  Bottom 1.016: 168,70.13 STM_SH1-1:JP2.20 160.13,72 STM_SH1-1:ENCODER.4
STM_SH1-1:PB_13
  Bottom 1: 168,67.59 168,68 STM_SH1-1:U$1.PB_13
  Bottom 1.016: STM_SH1-1:JP2.19 168,67.59 | STM_SH1-1:ENCODER.3 162.67,74.33 164,73 171,73 171,67.86 170.65,67.51 STM_SH1-1:U$1.PB_13
STM_SH1-1:PB_14
  Bottom 1: STM_SH1-1:U$1.PB_14 168,65 168,65.05
  Bottom 1.016: STM_SH1-1:JP2.18 168,65.05
STM_SH1-1:PB_15
  Bottom 1: STM_SH1-1:U$1.PB_15 168,62.5 168,62.51
  Bottom 1.016: STM_SH1-1:JP2.17 168,62.51
STM_SH1-1:PC_13
  Bottom 1: STM_SH1-1:JP1.19 189.5,24.5 189,24.32
  Bottom 1.016: 183,24.32 STM_SH1-1:U$1.PC_13 189,24.32
STM_SH1-1:PC_14
  Bottom 1: STM_SH1-1:JP1.18 189.5,27 189,26.86
  Bottom 1.016: 183,26.86 STM_SH1-1:U$1.PC_14 189,26.86
STM_SH1-1:PC_15
  Bottom 1: STM_SH1-1:JP1.17 189.5,29.5 189,29.4
  Bottom 1.016: 183,29.4 STM_SH1-1:U$1.PC_15 189,29.4
STM_SH1-1:RESET
  Bottom 1.016: 183,62.42 STM_SH1-1:U$1.RESET 189.16,62.42 STM_SH1-1:JP1.4
STM_SH1-1:VB
  Bottom 1: STM_SH1-1:JP1.20 189,22 189,21.78
  Bottom 1.016: 183,21.78 STM_SH1-1:U$1.VB 189,21.78
STM_SH2-1:3.3V@1
  Bottom 1: STM_SH2-1:U$1.3.3V_1 121.5,21 121.5,20.87
  Bottom 1.016: 122,21 121.87,20.87 121.5,20.87 STM_SH2-1:JP2.1 115.27,20.6 STM_SH2-1:U$1.3.3V_1
STM_SH2-1:3.3V@2
  Bottom 1: STM_SH2-1:JP1.3 142.86,63.78
  Bottom 1.016: STM_SH2-1:U$1.3.3V_2 142.86,63.78
STM_SH2-1:PA_0
  Bottom 1: STM_SH2-1:JP1.16 142.86,30.76
  Bottom 1.016: STM_SH2-1:U$1.PA_0 142.86,30.76
STM_SH2-1:PA_1
  Bottom 1: STM_SH2-1:JP1.15 142.86,33.3
  Bottom 1.016: STM_SH2-1:U$1.PA_1 142.86,33.3
STM_SH2-1:PA_2
  Bottom 1: STM_SH2-1:JP1.14 142.86,35.84
  Bottom 1.016: STM_SH2-1:U$1.PA_2 142.86,35.84
STM_SH2-1:PA_3
  Bottom 1: 142.86,38.38 STM_SH2-1:JP1.13
  Bottom 1.016: STM_SH2-1:U$1.PA_3 142.86,38.38
STM_SH2-1:PA_4
  Bottom 1: 142.86,40.92 STM_SH2-1:JP1.12
  Bottom 1.016: STM_SH2-1:U$1.PA_4 142.86,40.92
STM_SH2-1:PA_5
  Bottom 1: 142.86,43.46 STM_SH2-1:JP1.11
  Bottom 1.016: STM_SH2-1:U$1.PA_5 142.86,43.46
STM_SH2-1:PA_6
  Bottom 1: 142.86,46 145.87,46 145.87,19 STM_SH2-1:MOTOR_2.2 149.25,18.75 157,18.75 STM_SH2-1:MOTOR_1.2 | 142.86,46 STM_SH2-1:U$1.PA_6 135.75,46 | 142.86,46 STM_SH2-1:JP1.10
STM_SH2-1:PA_7
  Bottom 1: 142.86,48.5 148.11,48.5 148.11,22.43 STM_SH2-1:MOTOR_2.1 149.25,21.25 157,21.25 STM_SH2-1:MOTOR_1.1 | 142.86,48.5 137,48.5 | 137,48.5 135.75,48.5 | 137,48.5 STM_SH2-1:U$1.PA_7 | 142.86,48.5 STM_SH2-1:JP1.9
STM_SH2-1:PA_8
  Bottom 1: 115,58.75 109,58.75 STM_SH2-1:TTL_B.2 | 115,58.75 120,58.75 120.25,58.75 | 115,59 STM_SH2-1:JP2.16 115,58.75
  Bottom 1.016: STM_SH2-1:U$1.PA_8 120.05,58.7 120,58.75
STM_SH2-1:PA_9
  Bottom 1: 115,56.25 109,56.25 STM_SH2-1:TTL_B.1 | 115,56.25 120,56.25 120.25,56.25 | 115,56.5 STM_SH2-1:JP2.15 115,56.25
  Bottom 1.016: STM_SH2-1:U$1.PA_9 120.09,56.16 120,56.25
STM_SH2-1:PA_10
  Bottom 1: STM_SH2-1:U$1.PA_10 121.5,54 121.5,53.89
  Bottom 1.016: STM_SH2-1:JP2.14 121.5,53.89 122,53.89
STM_SH2-1:PA_11
  Bottom 1: STM_SH2-1:U$1.PA_11 121.5,51.5 121.5,51.35
  Bottom 1.016: STM_SH2-1:JP2.13 121.5,51.35 122,51.35
STM_SH2-1:PA_12
  Bottom 1: STM_SH2-1:U$1.PA_12 121.5,49 121.5,48.81
  Bottom 1.016: STM_SH2-1:JP2.12 121.5,48.81 122,48.81
STM_SH2-1:PA_15
  Bottom 1: STM_SH2-1:U$1.PA_15 121.5,46 121.5,46.27
  Bottom 1.016: STM_SH2-1:JP2.11 121.5,46.27 122,46.27
STM_SH2-1:PB_0
  Bottom 1: 142.86,51.63 STM_SH2-1:JP1.8 142.86,51.08
  Bottom 1.016: STM_SH2-1:U$1.PB_0 142.86,51.08
STM_SH2-1:PB_1
  Bottom 1: 142.86,54.13 STM_SH2-1:JP1.7 142.86,53.62
  Bottom 1.016: STM_SH2-1:U$1.PB_1 142.86,53.62
STM_SH2-1:PB_3
  Bottom 1: STM_SH2-1:U$1.PB_3 121.5,43.5 121.5,43.73
  Bottom 1.016: STM_SH2-1:JP2.10 121.5,43.73 122,43.73
STM_SH2-1:PB_4
  Bottom 1: STM_SH2-1:U$1.PB_4 121.5,41 121.5,41.19
  Bottom 1.016: STM_SH2-1:JP2.9 121.5,41.19 122,41.19
STM_SH2-1:PB_5
  Bottom 1: STM_SH2-1:U$1.PB_5 121.5,38.5 121.5,38.65
  Bottom 1.016: STM_SH2-1:JP2.8 121.5,38.65 122,38.65
STM_SH2-1:PB_6
  Bottom 1: STM_SH2-1:U$1.PB_6 121.5,36 121.5,36.11
  Bottom 1.016: STM_SH2-1:JP2.7 121.5,36.11 122,36.11
STM_SH2-1:PB_7
  Bottom 1: STM_SH2-1:U$1.PB_7 121.5,33.5 121.5,33.57
  Bottom 1.016: STM_SH2-1:JP2.6 121.5,33.57 122,33.57
STM_SH2-1:PB_8
  Bottom 1: STM_SH2-1:U$1.PB_8 121.5,31 121.5,31.03
  Bottom 1.016: STM_SH2-1:JP2.5 121.5,31.03 122,31.03
STM_SH2-1:PB_9
  Bottom 1: STM_SH2-1:U$1.PB_9 121.5,28.5 121.5,28.49
  Bottom 1.016: STM_SH2-1:JP2.4 121.5,28.49 122,28.49
STM_SH2-1:PB_10
  Bottom 1: 144,76 STM_SH2-1:TTL_A.1 | 143.5,56.16 143.5,56.65 STM_SH2-1:JP1.6
  Bottom 1.016: STM_SH2-1:U$1.PB_10 143.5,56.16 144,56.16 | STM_SH2-1:TTL_A.1 146,76 147.86,74.14 147.86,56.13 143.29,56.13 STM_SH2-1:JP1.6
STM_SH2-1:PB_11
  Bottom 1: 141.5,76 STM_SH2-1:TTL_A.2 | 143.5,58.7 143.5,59.14 STM_SH2-1:JP1.5
  Bottom 1.016: STM_SH2-1:U$1.PB_11 143.5,58.7 144,58.7 | STM_SH2-1:TTL_A.2 141.27,72 145.73,72 145.73,58.87 143.08,58.87 STM_SH2-1:JP1.5
STM_SH2-1:PB_12
  Bottom 1.016: STM_SH2-1:U$1.PB_12 121.11,69.13 STM_SH2-1:JP2.20 113.19,70.94 STM_SH2-1:ENCODER.4
STM_SH2-1:PB_13
  Bottom 1: STM_SH2-1:U$1.PB_13 121.5,66.5 121,66.59
  Bottom 1.016: STM_SH2-1:JP2.19 121,66.59 121.59,66 125,66 125,71 117,71 115.73,72.27 STM_SH2-1:ENCODER.3
STM_SH2-1:PB_14
  Bottom 1.016: STM_SH2-1:JP2.18 121,64.05 121.27,63.78 STM_SH2-1:U$1.PB_14
STM_SH2-1:PB_15
  Bottom 1: STM_SH2-1:U$1.PB_15 121.5,61.5 121,61.51
  Bottom 1.016: STM_SH2-1:JP2.17 121,61.51
STM_SH2-1:PC_13
  Bottom 1: 142.86,23.63 STM_SH2-1:JP1.19 142.86,23.14
  Bottom 1.016: STM_SH2-1:U$1.PC_13 142.86,23.14
STM_SH2-1:PC_14
  Bottom 1: 142.86,26.13 STM_SH2-1:JP1.18 142.86,25.68
  Bottom 1.016: STM_SH2-1:U$1.PC_14 142.86,25.68
STM_SH2-1:PC_15
  Bottom 1: STM_SH2-1:JP1.17 142.86,28.22
  Bottom 1.016: STM_SH2-1:U$1.PC_15 142.86,28.22
STM_SH2-1:RESET
  Bottom 1: STM_SH2-1:JP1.4 142.86,61.24
  Bottom 1.016: STM_SH2-1:U$1.RESET 142.86,61.24
STM_SH2-1:VB
  Bottom 1: 142.86,21.13 STM_SH2-1:JP1.20 142.86,20.6
  Bottom 1.016: STM_SH2-1:U$1.VB 142.86,20.6
STM_SH3-1:3.3V@1
  Bottom 1.016: STM_SH3-1:JP2.1 71.11,20.87 STM_SH3-1:U$1.3.3V_1
STM_SH3-1:3.3V@2
  Bottom 1: STM_SH3-1:JP1.3 92.5,64 92.5,63.78
  Bottom 1.016: STM_SH3-1:U$1.3.3V_2 92.5,63.78 93,63.78
STM_SH3-1:PA_0
  Bottom 1: STM_SH3-1:JP1.16 92.5,31 92.5,30.76
  Bottom 1.016: STM_SH3-1:U$1.PA_0 92.5,30.76 93,30.76
STM_SH3-1:PA_1
  Bottom 1: STM_SH3-1:JP1.15 92.5,33.5 92.5,33.3
  Bottom 1.016: STM_SH3-1:U$1.PA_1 92.5,33.3 93,33.3
STM_SH3-1:PA_2
  Bottom 1: STM_SH3-1:JP1.14 92.5,36 92.5,35.84
  Bottom 1.016: STM_SH3-1:U$1.PA_2 92.5,35.84 93,35.84
STM_SH3-1:PA_3
  Bottom 1: STM_SH3-1:JP1.13 92.5,38.5 92.5,38.38
  Bottom 1.016: STM_SH3-1:U$1.PA_3 92.5,38.38 93,38.38
STM_SH3-1:PA_4
  Bottom 1: STM_SH3-1:JP1.12 92.5,41 92.5,40.92
  Bottom 1.016: STM_SH3-1:U$1.PA_4 92.5,40.92 93,40.92
STM_SH3-1:PA_5
  Bottom 1: STM_SH3-1:JP1.11 92.5,43.5 92.5,43.46
  Bottom 1.016: STM_SH3-1:U$1.PA_5 92.5,43.46 93,43.46
STM_SH3-1:PA_6
  Bottom 1: 92.5,46 95.76,46 95.76,19 STM_SH3-1:MOTOR_2.2 99.25,18.75 106.61,18.75 STM_SH3-1:MOTOR_1.2 | 92.5,46 STM_SH3-1:U$1.PA_6 86.25,46 | 92.5,46 STM_SH3-1:JP1.10
STM_SH3-1:PA_7
  Bottom 1: 92.5,48.5 99,48.5 STM_SH3-1:MOTOR_2.1 99,21.27 STM_SH3-1:MOTOR_1.1 | 92.5,48.5 87,48.5 | 87,48.5 86.25,48.5 | 87,48.5 STM_SH3-1:U$1.PA_7 | 92.5,48.5 STM_SH3-1:JP1.9
STM_SH3-1:PA_8
  Bottom 1: 70.75,58.75 65,58.75 | 65,58.75 56,58.75 STM_SH3-1:TTL_B.2 | 65,59 STM_SH3-1:JP2.16 65,58.75
  Bottom 1.016: STM_SH3-1:U$1.PA_8 70.8,58.7 70.75,58.75
STM_SH3-1:PA_9
  Bottom 1: 70.75,56.25 65,56.25 | 65,56.25 56,56.25 STM_SH3-1:TTL_B.1 | 65,56.5 STM_SH3-1:JP2.15 65,56.25
  Bottom 1.016: STM_SH3-1:U$1.PA_9 70.84,56.16 70.75,56.25
STM_SH3-1:PA_10
  Bottom 1.016: STM_SH3-1:JP2.14 71,53.89 | 71,53.89 72,53.89 | STM_SH3-1:U$1.PA_10 71.27,53.62 71,53.89
STM_SH3-1:PA_11
  Bottom 1.016: STM_SH3-1:JP2.13 71,51.35 | 71,51.35 72,51.35 | STM_SH3-1:U$1.PA_11 71.27,51.08 71,51.35
STM_SH3-1:PA_12
  Bottom 1: STM_SH3-1:U$1.PA_12 71.5,49 71.5,48.81
  Bottom 1.016: STM_SH3-1:JP2.12 71.5,48.81 72,48.81
STM_SH3-1:PA_15
  Bottom 1: STM_SH3-1:U$1.PA_15 71.5,46 71.5,46.27
  Bottom 1.016: STM_SH3-1:JP2.11 71.5,46.27 72,46.27
STM_SH3-1:PB_0
  Bottom 1: STM_SH3-1:JP1.8 92.5,51.5 92.5,51.08
  Bottom 1.016: STM_SH3-1:U$1.PB_0 92.5,51.08 93,51.08
STM_SH3-1:PB_1
  Bottom 1: STM_SH3-1:JP1.7 92.5,54 92.5,53.62
  Bottom 1.016: STM_SH3-1:U$1.PB_1 92.5,53.62 93,53.62
STM_SH3-1:PB_3
  Bottom 1: STM_SH3-1:U$1.PB_3 71.5,43.5 71.5,43.73
  Bottom 1.016: STM_SH3-1:JP2.10 71.5,43.73 72,43.73
STM_SH3-1:PB_4
  Bottom 1: STM_SH3-1:U$1.PB_4 71.5,41 71.5,41.19
  Bottom 1.016: STM_SH3-1:JP2.9 71.5,41.19 72,41.19
STM_SH3-1:PB_5
  Bottom 1: STM_SH3-1:U$1.PB_5 71.5,38.5 71.5,38.65
  Bottom 1.016: STM_SH3-1:JP2.8 71.5,38.65 72,38.65
STM_SH3-1:PB_6
  Bottom 1: STM_SH3-1:U$1.PB_6 71.5,36 71.5,36.11
  Bottom 1.016: STM_SH3-1:JP2.7 71.5,36.11 72,36.11
STM_SH3-1:PB_7
  Bottom 1: STM_SH3-1:U$1.PB_7 71.5,33.5 71.5,33.57
  Bottom 1.016: STM_SH3-1:JP2.6 71.5,33.57 72,33.57
STM_SH3-1:PB_8
  Bottom 1: STM_SH3-1:U$1.PB_8 71.5,31 71.5,31.03
  Bottom 1.016: STM_SH3-1:JP2.5 71.5,31.03 72,31.03
STM_SH3-1:PB_9
  Bottom 1: STM_SH3-1:U$1.PB_9 71.5,28.5 71.5,28.49
  Bottom 1.016: STM_SH3-1:JP2.4 71.5,28.49 72,28.49
STM_SH3-1:PB_10
  Bottom 1: 92.5,56.5 99,56.5 99,76 STM_SH3-1:TTL_A.1 | 92.5,56.5 86.5,56.5 | 86.5,56.5 86.25,56.5 | 86.5,56.5 STM_SH3-1:U$1.PB_10 | 92.5,56.5 STM_SH3-1:JP1.6
STM_SH3-1:PB_11
  Bottom 1: 92.5,59 97.02,59 97.02,72 91,72 90.5,72.5 90.5,76 STM_SH3-1:TTL_A.2 | 92.5,59 87,59 | 87,59 86.25,59 | 87,59 STM_SH3-1:U$1.PB_11 | 92.5,59 STM_SH3-1:JP1.5
STM_SH3-1:PB_12
  Bottom 1: STM_SH3-1:U$1.PB_12 71.5,69 71.5,69.13
  Bottom 1.016: STM_SH3-1:ENCODER.4 63.19,70.94 STM_SH3-1:JP2.20 71.5,69.13 72,69.13
STM_SH3-1:PB_13
  Bottom 1: 71,66.59 71,66.5 STM_SH3-1:U$1.PB_13
  Bottom 1.016: STM_SH3-1:ENCODER.3 65.73,73.27 67,72 74,72 75,71 75,66 71.7,66 STM_SH3-1:U$1.PB_13 | STM_SH3-1:JP2.19 71,66.59 72,66.59
STM_SH3-1:PB_14
  Bottom 1.016: STM_SH3-1:JP2.18 71,64.05 71.27,63.78 STM_SH3-1:U$1.PB_14
STM_SH3-1:PB_15
  Bottom 1.016: STM_SH3-1:JP2.17 71,61.51 71.27,61.24 STM_SH3-1:U$1.PB_15
STM_SH3-1:PC_13
  Bottom 1: STM_SH3-1:JP1.19 92.5,23.5 92.5,23.14
  Bottom 1.016: STM_SH3-1:U$1.PC_13 92.5,23.14 93,23.14
STM_SH3-1:PC_14
  Bottom 1: STM_SH3-1:JP1.18 92.5,26 92.5,25.68
  Bottom 1.016: STM_SH3-1:U$1.PC_14 92.5,25.68 93,25.68
STM_SH3-1:PC_15
  Bottom 1: STM_SH3-1:JP1.17 92.5,28.22
  Bottom 1.016: STM_SH3-1:U$1.PC_15 92.5,28.22 93,28.22
STM_SH3-1:RESET
  Bottom 1: STM_SH3-1:JP1.4 92.5,61.24
  Bottom 1.016: STM_SH3-1:U$1.RESET 92.5,61.24 93,61.24
STM_SH3-1:VB
  Bottom 1: STM_SH3-1:JP1.20 92.5,21 92.5,20.6
  Bottom 1.016: STM_SH3-1:U$1.VB 92.5,20.6 93,20.6
STM_SH4-1:3.3V@1
  Bottom 1: STM_SH4-1:U$1.3.3V_1 19.5,21 19.5,20.87
  Bottom 1.016: STM_SH4-1:JP2.1 19.5,20.87 20,20.87
STM_SH4-1:3.3V@2
  Bottom 1: STM_SH4-1:JP1.3 41,63.78
  Bottom 1.016: STM_SH4-1:U$1.3.3V_2 41,63.78
STM_SH4-1:PA_0
  Bottom 1: STM_SH4-1:JP1.16 41,30.76
  Bottom 1.016: STM_SH4-1:U$1.PA_0 41,30.76
STM_SH4-1:PA_1
  Bottom 1: STM_SH4-1:JP1.15 41,33.3
  Bottom 1.016: STM_SH4-1:U$1.PA_1 41,33.3
STM_SH4-1:PA_2
  Bottom 1: STM_SH4-1:JP1.14 41,35.84
  Bottom 1.016: STM_SH4-1:U$1.PA_2 41,35.84
STM_SH4-1:PA_3
  Bottom 1: 41,38.38 STM_SH4-1:JP1.13
  Bottom 1.016: STM_SH4-1:U$1.PA_3 41,38.38
STM_SH4-1:PA_4
  Bottom 1: 41,40.92 STM_SH4-1:JP1.12
  Bottom 1.016: STM_SH4-1:U$1.PA_4 41,40.92
STM_SH4-1:PA_5
  Bottom 1: 41,43.46 STM_SH4-1:JP1.11
  Bottom 1.016: STM_SH4-1:U$1.PA_5 41,43.46
STM_SH4-1:PA_6
  Bottom 1: 41,46 44,46 44,19.75 45.75,18 STM_SH4-1:MOTOR_2.2 47.25,17.75 55,17.75 STM_SH4-1:MOTOR_1.2 | 41,46 STM_SH4-1:U$1.PA_6 | 41,46 STM_SH4-1:JP1.10
STM_SH4-1:PA_7
  Bottom 1: 41,48.5 47,48.5 STM_SH4-1:MOTOR_2.1 47.25,20.25 55,20.25 STM_SH4-1:MOTOR_1.1 | 41,48.5 35,48.5 STM_SH4-1:U$1.PA_7 | 41,48.5 STM_SH4-1:JP1.9
STM_SH4-1:PA_8
  Bottom 1: 13,58.75 6.97,58.75 STM_SH4-1:TTL_B.2 | 13,58.75 19.5,58.75 | 19.5,58.75 20,58.75 | STM_SH4-1:U$1.PA_8 19.5,59 19.5,58.75 | 13,58.75 STM_SH4-1:JP2.16 13,59
STM_SH4-1:PA_9
  Bottom 1: 13,56.25 6.97,56.25 STM_SH4-1:TTL_B.1 | 13,56.25 19.5,56.25 | 19.5,56.25 20,56.25 | STM_SH4-1:U$1.PA_9 19.5,56.5 19.5,56.25 | 13,56.25 STM_SH4-1:JP2.15 13,56.5
STM_SH4-1:PA_10
  Bottom 1: STM_SH4-1:U$1.PA_10 19.5,54 19.5,53.89
  Bottom 1.016: STM_SH4-1:JP2.14 19.5,53.89 20,53.89
STM_SH4-1:PA_11
  Bottom 1: STM_SH4-1:U$1.PA_11 19.5,51.5 19.5,51.35
  Bottom 1.016: STM_SH4-1:JP2.13 19.5,51.35 20,51.35
STM_SH4-1:PA_12
  Bottom 1: STM_SH4-1:U$1.PA_12 19.5,49 19.5,48.81
  Bottom 1.016: STM_SH4-1:JP2.12 19.5,48.81 20,48.81
STM_SH4-1:PA_15
  Bottom 1: STM_SH4-1:U$1.PA_15 19.5,46 19.5,46.27
  Bottom 1.016: STM_SH4-1:JP2.11 19.5,46.27 20,46.27
STM_SH4-1:PB_0
  Bottom 1: 41,51.5 STM_SH4-1:JP1.8 41,51.08
  Bottom 1.016: STM_SH4-1:U$1.PB_0 41,51.08
STM_SH4-1:PB_1
  Bottom 1: 41,54 STM_SH4-1:JP1.7 41,53.62
  Bottom 1.016: STM_SH4-1:U$1.PB_1 41,53.62
STM_SH4-1:PB_3
  Bottom 1: STM_SH4-1:U$1.PB_3 19.5,43.5 19.5,43.73
  Bottom 1.016: STM_SH4-1:JP2.10 19.5,43.73 20,43.73
STM_SH4-1:PB_4
  Bottom 1: STM_SH4-1:U$1.PB_4 19.5,41 19.5,41.19
  Bottom 1.016: STM_SH4-1:JP2.9 19.5,41.19 20,41.19
STM_SH4-1:PB_5
  Bottom 1: STM_SH4-1:U$1.PB_5 19.5,38.5 19.5,38.65
  Bottom 1.016: STM_SH4-1:JP2.8 19.5,38.65 20,38.65
STM_SH4-1:PB_6
  Bottom 1: STM_SH4-1:U$1.PB_6 19.5,36 19.5,36.11
  Bottom 1.016: STM_SH4-1:JP2.7 19.5,36.11 20,36.11
STM_SH4-1:PB_7
  Bottom 1: STM_SH4-1:U$1.PB_7 19.5,33.5 19.5,33.57
  Bottom 1.016: STM_SH4-1:JP2.6 19.5,33.57 20,33.57
STM_SH4-1:PB_8
  Bottom 1: STM_SH4-1:U$1.PB_8 19.5,31 19.5,31.03
  Bottom 1.016: STM_SH4-1:JP2.5 19.5,31.03 20,31.03
STM_SH4-1:PB_9
  Bottom 1: STM_SH4-1:U$1.PB_9 19.5,28.5 19.5,28.49
  Bottom 1.016: STM_SH4-1:JP2.4 19.5,28.49 20,28.49
STM_SH4-1:PB_10
  Bottom 1: 41,56.5 47.25,56.5 47.25,72.75 45.81,74.19 45.62,74.19 STM_SH4-1:TTL_A.1 | 41,56.5 38,56.5 | 38,56.5 35.5,56.5 | 41,56.5 STM_SH4-1:JP1.6 41,56.16 | 38,56.5 38,56.16
  Bottom 1.016: STM_SH4-1:U$1.PB_10 38,56.16 41,56.16
STM_SH4-1:PB_11
  Bottom 1: 41,59 45.25,59 45.25,70.75 41.5,74.5 41.5,75.77 STM_SH4-1:TTL_A.2 | 41,59 38,59 | 38,59 35.5,59 | 41,59 STM_SH4-1:JP1.5 41,58.7 | 38,59 38,58.7
  Bottom 1.016: STM_SH4-1:U$1.PB_11 38,58.7 41,58.7
STM_SH4-1:PB_12
  Bottom 1.016: STM_SH4-1:ENCODER.4 12.68,69.45 STM_SH4-1:JP2.20 19,69.13 19.27,68.86 STM_SH4-1:U$1.PB_12
STM_SH4-1:PB_13
  Bottom 1: 19,66.59 19,66.5 STM_SH4-1:U$1.PB_13
  Bottom 1.016: STM_SH4-1:JP2.19 19,66.59 | STM_SH4-1:ENCODER.3 15.22,72.78 15.86,72.14 22.25,72.14 22.25,66 19.7,66 STM_SH4-1:U$1.PB_13
STM_SH4-1:PB_14
  Bottom 1.016: STM_SH4-1:JP2.18 19.11,64.05 STM_SH4-1:U$1.PB_14
STM_SH4-1:PB_15
  Bottom 1.016: STM_SH4-1:JP2.17 19.11,61.51 STM_SH4-1:U$1.PB_15
STM_SH4-1:PC_13
  Bottom 1: 41,23.5 STM_SH4-1:JP1.19 41,23.14
  Bottom 1.016: STM_SH4-1:U$1.PC_13 41,23.14
STM_SH4-1:PC_14
  Bottom 1: 41,26 STM_SH4-1:JP1.18 41,25.68
  Bottom 1.016: STM_SH4-1:U$1.PC_14 41,25.68
STM_SH4-1:PC_15
  Bottom 1: STM_SH4-1:JP1.17 41,28.22
  Bottom 1.016: STM_SH4-1:U$1.PC_15 41,28.22
STM_SH4-1:RESET
  Bottom 1: STM_SH4-1:JP1.4 41,61.24
  Bottom 1.016: STM_SH4-1:U$1.RESET 41,61.24
STM_SH4-1:VB
  Bottom 1: 41,21 STM_SH4-1:JP1.20 41,20.6
  Bottom 1.016: STM_SH4-1:U$1.VB 41,20.6